# EAGLE design pcb 06 (EAGLE 9.2.0)
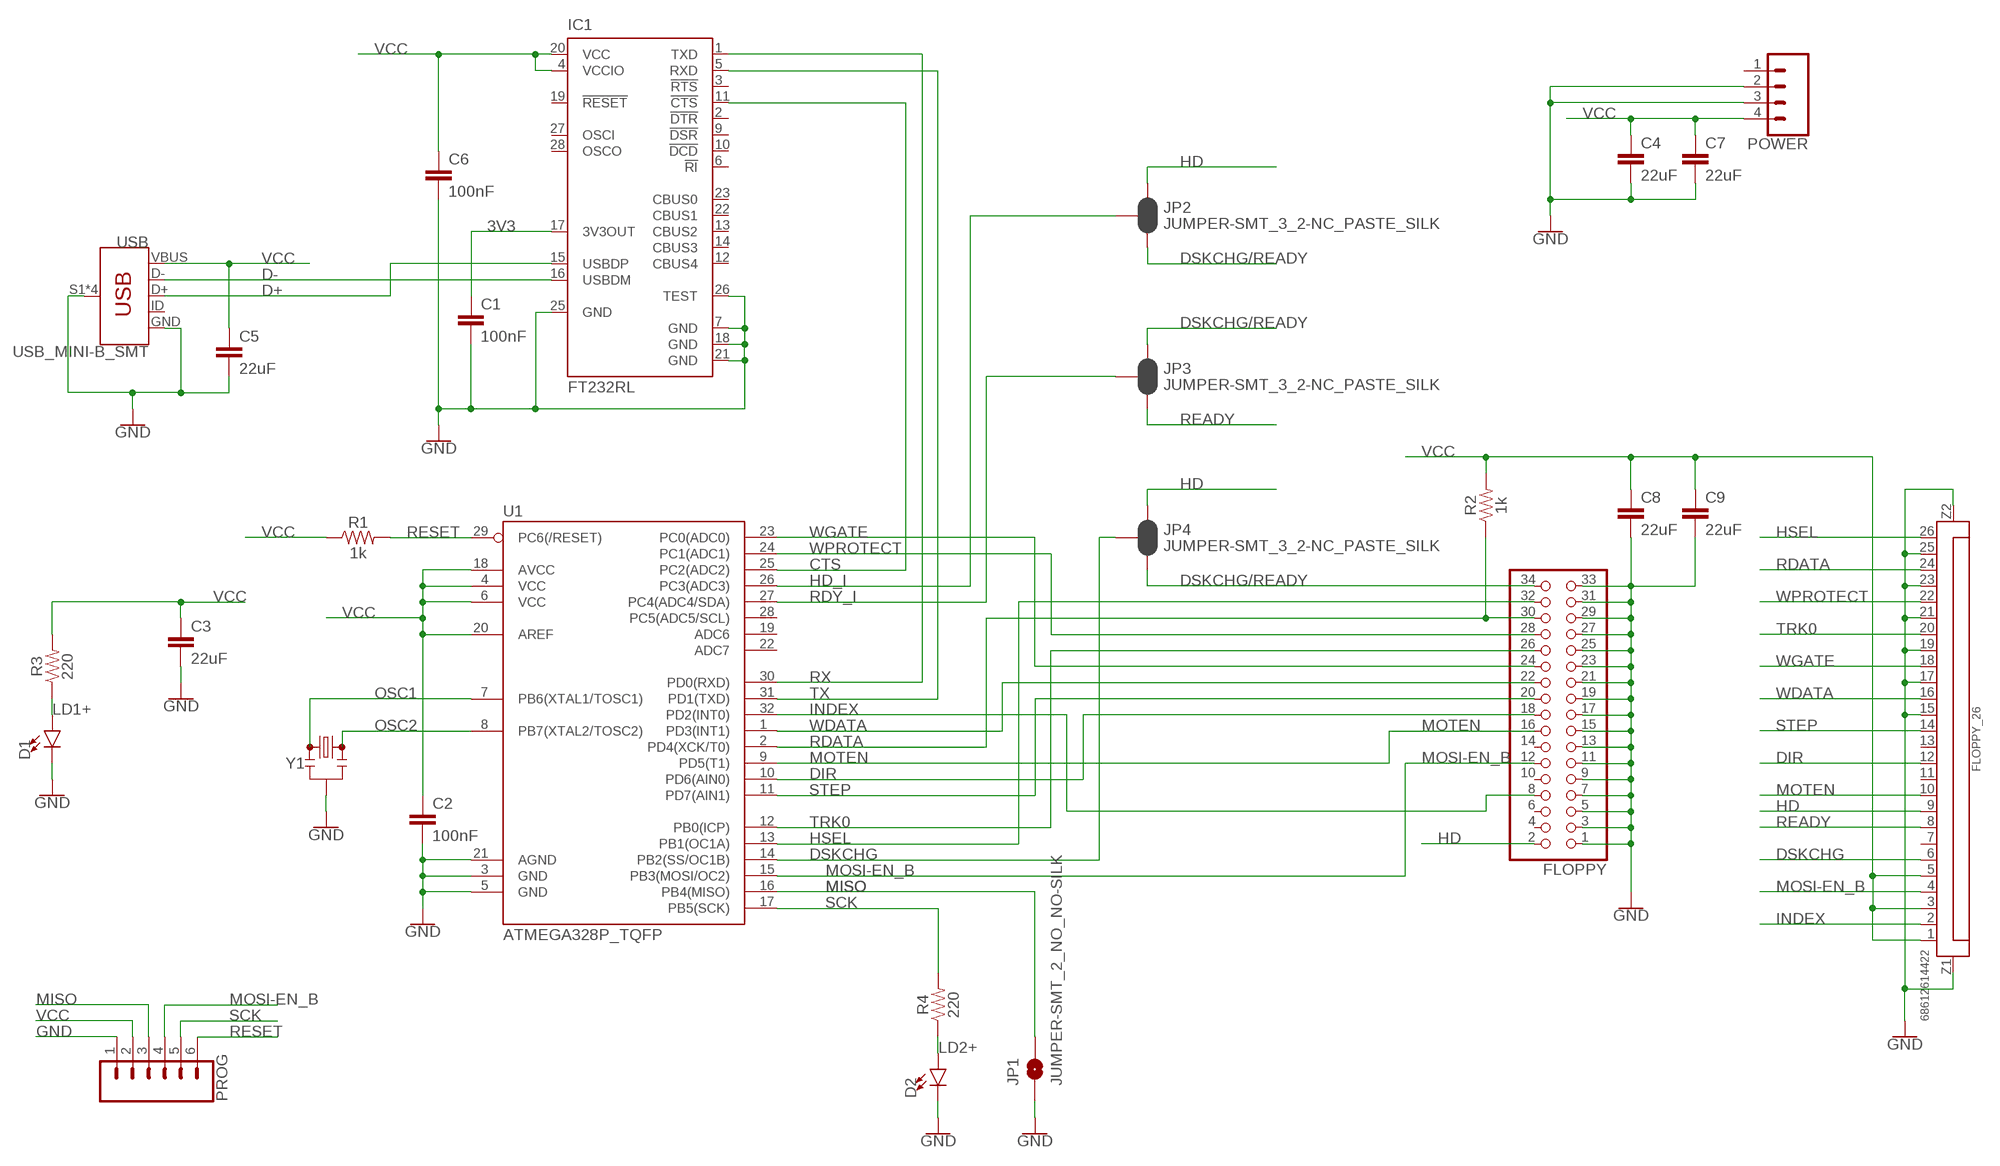
[diagram p0: schematic, sheet 1]

## Parts
C1  100nF  1.0UF-0603-16V-10%  [0603]
C2  100nF  1.0UF-0603-16V-10%  [0603]
C3  22uF  C-EUC0805  [C0805]
C4  22uF  C-EUC0805  [C0805]
C5  22uF  C-EUC0805  [C0805]
C6  100nF  1.0UF-0603-16V-10%  [0603]
C7  22uF  C-EUC0805  [C0805]
C8  22uF  C-EUC0805  [C0805]
C9  22uF  C-EUC0805  [C0805]
D1  LED5MM  [LED_5MM]
D2  LED5MM  [LED_5MM]
FLOPPY  PINHD-2X17_2.54-90°  [2X17/90]
FLOPPY_26  68612614422  6861XX14422_68612614422  [68612614422]
IC1  FT232RL  [SSOP28]
JP1  JUMPER-SMT_2_NO_NO-SILK  [SMT-JUMPER_2_NO_NO-SILK]
JP2  JUMPER-SMT_3_2-NC_PASTE_SILK  [SMT-JUMPER_3_2-NC_PASTE_SILK]
JP3  JUMPER-SMT_3_2-NC_PASTE_SILK  [SMT-JUMPER_3_2-NC_PASTE_SILK]
JP4  JUMPER-SMT_3_2-NC_PASTE_SILK  [SMT-JUMPER_3_2-NC_PASTE_SILK]
POWER  CONN_04  [1X04]
PROG  CONN_06SILK_FEMALE_PTH  [1X06]
R1  1k  10KOHM-0603-1/10W-1%  [0603]
R2  1k  10KOHM-0603-1/10W-1%  [0603]
R3  220  10KOHM-0603-1/10W-1%  [0603]
R4  220  10KOHM-0603-1/10W-1%  [0603]
U1  ATMEGA328P_TQFP  [TQFP32-08]
USB  USB_MINI-B_SMT  [USB-MINIB]
Y1  RESONATORSMD-3.2X1.3  [RESONATOR-SMD-3.2X1.3]

## Nets
3V3: C1.1 IC1.17(3V3OUT)
CTS: IC1.11(!CTS) U1.25(PC2(ADC2))
D+: IC1.15(USBDP) USB.D+
D-: IC1.16(USBDM) USB.D-
DIR: FLOPPY.18 FLOPPY_26.12 U1.10(PD6(AIN0))
DSKCHG: FLOPPY_26.6 JP4.2 U1.14(PB2(SS/OC1B))
DSKCHG/READY: FLOPPY.34 JP2.3 JP3.1 JP4.3
GND: C1.2 C2.2 C3.2 C4.2 C5.2 C6.2 C7.2 C8.2 C9.2 D1.K(C) D2.K(C) FLOPPY.1 FLOPPY.3 FLOPPY.5 FLOPPY.7 FLOPPY.9 FLOPPY.11 FLOPPY.13 FLOPPY.15 FLOPPY.17 FLOPPY.19 FLOPPY.21 FLOPPY.23 FLOPPY.25 FLOPPY.27 FLOPPY.29 FLOPPY.31 FLOPPY.33 FLOPPY_26.15 FLOPPY_26.17 FLOPPY_26.19 FLOPPY_26.21 FLOPPY_26.23 FLOPPY_26.25 FLOPPY_26.Z1 FLOPPY_26.Z2 IC1.7(GND) IC1.18(GND) IC1.21(GND) IC1.25(GND) IC1.26(TEST) JP1.1 POWER.2 POWER.3 PROG.1 U1.3(GND) U1.5(GND) U1.21(AGND) USB.GND USB.S1(SHIELD) USB.S2(SHIELD) USB.S3(SHIELD) USB.S4(SHIELD) Y1.2
HD: FLOPPY.2 FLOPPY_26.9 JP2.1 JP4.1
HD_I: JP2.2 U1.26(PC3(ADC3))
HSEL: FLOPPY.32 FLOPPY_26.26 U1.13(PB1(OC1A))
INDEX: FLOPPY.8 FLOPPY_26.2 U1.32(PD2(INT0))
LD1+: D1.A R3.1
LD2+: D2.A R4.1
MISO: JP1.2 PROG.3 U1.16(PB4(MISO))
MOSI-EN_B: FLOPPY.12 FLOPPY_26.4 PROG.4 U1.15(PB3(MOSI/OC2))
MOTEN: FLOPPY.16 FLOPPY_26.10 U1.9(PD5(T1))
OSC1: U1.7(PB6(XTAL1/TOSC1)) Y1.1
OSC2: U1.8(PB7(XTAL2/TOSC2)) Y1.3
RDATA: FLOPPY.30 FLOPPY_26.24 R2.1 U1.2(PD4(XCK/T0))
RDY_I: JP3.2 U1.27(PC4(ADC4/SDA))
READY: FLOPPY_26.8 JP3.3
RESET: PROG.6 R1.2 U1.29(PC6(/RESET))
RX: IC1.1(TXD) U1.30(PD0(RXD))
SCK: PROG.5 R4.2 U1.17(PB5(SCK))
STEP: FLOPPY.20 FLOPPY_26.14 U1.11(PD7(AIN1))
TRK0: FLOPPY.26 FLOPPY_26.20 U1.12(PB0(ICP))
TX: IC1.5(RXD) U1.31(PD1(TXD))
VCC: C2.1 C3.1 C4.1 C5.1 C6.1 C7.1 C8.1 C9.1 FLOPPY_26.1 FLOPPY_26.3 FLOPPY_26.5 IC1.4(VCCIO) IC1.20(VCC) POWER.4 PROG.2 R1.1 R2.2 R3.2 U1.4(VCC) U1.6(VCC) U1.18(AVCC) U1.20(AREF) USB.VBUS
WDATA: FLOPPY.22 FLOPPY_26.16 U1.1(PD3(INT1))
WGATE: FLOPPY.24 FLOPPY_26.18 U1.23(PC0(ADC0))
WPROTECT: FLOPPY.28 FLOPPY_26.22 U1.24(PC1(ADC1))
Unconnected: FLOPPY.4 FLOPPY.6 FLOPPY.10 FLOPPY.14 FLOPPY_26.7 FLOPPY_26.11 FLOPPY_26.13 IC1.2(!DTR) IC1.3(!RTS) IC1.6(!RI) IC1.9(!DSR) IC1.10(!DCD) IC1.12(CBUS4) IC1.13(CBUS2) IC1.14(CBUS3) IC1.19(!RESET) IC1.22(CBUS1) IC1.23(CBUS0) IC1.27(OSCI) IC1.28(OSCO) POWER.1 U1.19(ADC6) U1.22(ADC7) U1.28(PC5(ADC5/SCL)) USB.ID

## Library data of the parts
C1 C2 C6 = SparkFun-Capacitors:1.0UF: 1µF ceramic capacitors A capacitor is a passive two-terminal electrical component used to store electrical energy temporarily in an electric field.; PROD_ID: CAP-00868; VALUE: 1.0uF
C3-C5 C7-C9 = resistor:C-EU: CAPACITOR, European symbol
D1 D2 = SparkFun-LED:LED: LED (Generic) Standard schematic elements and footprints for 5mm, 3mm, 1206, and 0603 sized LEDs. Generic LEDs with no color specified.
FLOPPY = pinhead-1:PINHD-2X17: PIN HEADER
FLOPPY_26 = Wurth_Connectors_WR-FPC:6861XX14422_68612614422: WR-FPC 1.00 mm SMT ZIF Horizontal Bottom Contact KIND PROPERTIES Pitch 1 mm MATERIAL PROPERTIES Insulator Material PPS Contact Material Phosphor Bronze Contact Plating 100 (µ") Tin over 50 (µ") Nickel Contact Type Stamped <https://www.we-online.com/catalog/media/o33099v209%20Family_WR-FPC_68611214422.jpg> Details see: https://www.we-online.com/catalog/en/FPC_1_00_SMT_ZIF_HORIZONTAL_BOTTOM_CONTACT_6861XX14422/ Updated by Ella Wu 2020-08-26 2020(C) Wurth Elektronik; CONTACT-RESISTANCE: 20Ohm; DATASHEET-URL: https://www.we-online.com/catalog/datasheet/68612614422.pdf; IR: 1A; L: 33mm; MATE-WITH: WR-FFC 1.00 mm Flat Flexible Cable Type 1 (Contacts on same side)/ Type 2 (Contacts opposite); PACKAGING: Tape and Reel; PART-NUMBER: 68612614422; PINS: 26; PITCH: 1mm; TYPE: Horizontal; WORKING-VOLTAGE: 125V(AC)
IC1 = ftdichip:FT232R: Source: http://www.ftdichip.com/Documents/DataSheets/DS_FT232R_v104.pdf; MPN: FT232RL; OC_FARNELL: 1146032; OC_NEWARK: 91K9918
JP1 = SparkFun-Jumpers:JUMPER-SMT_2_NO: Normally open jumper This jumper has two pads in close proximity to each other. Apply solder to close the connection. Round pads are easier to solder for beginners, but are a lot larger. SparkFun Product that uses the round pads: SparkFun EL Sequencer <https://www.sparkfun.com/products/12781>
JP2-JP4 = SparkFun-Jumpers:JUMPER-SMT_3_2-NC_PASTE: Normally closed solder jumper (2 of 2 connections) This jumper has an aperture in the stencil to allow solder paste to bridge both connections. Both connections are normally closed (NC). Wick off the solder to open the connection(s). Reapply solder to reclose the connection(s).
POWER = SparkFun-Connectors:CONN_04: Multi connection point. Often used as Generic Header-pin footprint for 0.1 inch spaced/style header connections On any of the 0.1 inch spaced packages, you can populate with these: Break Away Headers - Straight <https://www.sparkfun.com/products/116> (PRT-00116) Break Away Male Headers - Right Angle <https://www.sparkfun.com/products/553> (PRT-00553) Female Headers <https://www.sparkfun.com/products/115> (PRT-00115) Break Away Headers - Machine Pin <https://www.sparkfun.com/products/117> (PRT-00117) Break Away Female Headers - Swiss Machine Pin <https://www.sparkfun.com/products/743> (PRT-00743) For SCREWTERMINALS and SPRING TERMINALS visit here: Screw Terimnals on SparkFun.com <https://www.sparkfun.com/search/results?term=Screw+Terminals> (5mm/3.5mm/2.54mm spacing) This device is also useful as a general connection point to wire up your design to another part of your project. Our various solder wires solder well into these plated through hole pads. Hook-Up Wire - Assortment (Stranded, 22 AWG) <https://www.sparkfun.com/products/11375> (PRT-11375) Hook-Up Wire - Assortment (Solid Core, 22 AWG) <https://www.sparkfun.com/products/11367> (PRT-11367) View the entire wire category on our website here <https://www.sparkfun.com/categories/141> Special notes: Molex polarized connector foot print use with SKU : PRT-08231 with associated crimp pins and housings. 1MM SMD Version SKU: PRT-10208; PROD_ID: CONN-09696
PROG = SparkFun-Connectors:CONN_06: Multi connection point. Often used as Generic Header-pin footprint for 0.1 inch spaced/style header connections On any of the 0.1 inch spaced packages, you can populate with these: Break Away Headers - Straight <https://www.sparkfun.com/products/116> (PRT-00116) Break Away Male Headers - Right Angle <https://www.sparkfun.com/products/553> (PRT-00553) Female Headers <https://www.sparkfun.com/products/115> (PRT-00115) Break Away Headers - Machine Pin <https://www.sparkfun.com/products/117> (PRT-00117) Break Away Female Headers - Swiss Machine Pin <https://www.sparkfun.com/products/743> (PRT-00743) Arduino Stackable Header - 6 Pin <https://www.sparkfun.com/products/9280> (PRT-09280) For SCREWTERMINALS and SPRING TERMINALS visit here: Screw Terimnals on SparkFun.com <https://www.sparkfun.com/search/results?term=Screw+Terminals> (5mm/3.5mm/2.54mm spacing) This device is also useful as a general connection point to wire up your design to another part of your project. Our various solder wires solder well into these plated through hole pads. Hook-Up Wire - Assortment (Stranded, 22 AWG) <https://www.sparkfun.com/products/11375> (PRT-11375) Hook-Up Wire - Assortment (Solid Core, 22 AWG) <https://www.sparkfun.com/products/11367> (PRT-11367) View the entire wire category on our website here <https://www.sparkfun.com/categories/141>; PROD_ID: CONN-08437
R1-R4 = SparkFun-Resistors:10KOHM: 10kΩ resistor A resistor is a passive two-terminal electrical component that implements electrical resistance as a circuit element. Resistors act to reduce current flow, and, at the same time, act to lower voltage levels within circuits. - Wikipedia; PROD_ID: RES-00824; VALUE: 10k
U1 = SparkFun-IC-Microcontroller:ATMEGA328P_TQFP: Popular 328P in QFP Storefront component: ATmega328 - TQFP <https://www.sparkfun.com/products/13448> (COM-13448) Datasheet <http://www.sparkfun.com/datasheets/Components/SMD/ATMega328.pdf> SparkFun Products SparkFun RedBoard - Programmed with Arduino <https://www.sparkfun.com/products/12757> (DEV-12757) Arduino Pro Mini 328 - 5V/16MHz <https://www.sparkfun.com/products/11113> (DEV-11113) Arduino Pro Mini 328 - 3.3V/8MHz <https://www.sparkfun.com/products/11114> (DEV-11114) SparkFun OpenLog <https://www.sparkfun.com/products/13712> (DEV-13712) SparkFun MicroView - OLED Arduino Module <https://www.sparkfun.com/products/12923> (DEV-12923) SparkFun Digital Sandbox <https://www.sparkfun.com/products/12651> (DEV-12651) SparkFun PicoBoard <https://www.sparkfun.com/products/11888> (WIG-11888) Arduino Fio <https://www.sparkfun.com/products/10116> (DEV-10116) LilyPad Arduino 328 Main Board <https://www.sparkfun.com/products/13342> (DEV-13342) SparkFun RedStick <https://www.sparkfun.com/products/13741> (DEV-13741) LilyPad MP3 <https://www.sparkfun.com/products/11013> (DEV-11013) LilyPad Arduino SimpleSnap <https://www.sparkfun.com/products/10941> (DEV-10941) SparkFun Stepoko <https://www.sparkfun.com/products/13899> (ROB-13899) SparkFun Geiger Counter <https://www.sparkfun.com/products/11345> (SEN-11345) SparkFun EL Sequencer <https://www.sparkfun.com/products/12781> (COM-12781) Arduino Pro 328 - 5V/16MHz <https://www.sparkfun.com/products/10915> (DEV-10915) CryptoCape <https://www.sparkfun.com/products/12773> (DEV-12773) SparkFun IR Thermometer Evaluation Board - MLX90614 <https://www.sparkfun.com/products/10740> (SEN-10740) SparkFun RedBot Mainboard <https://www.sparkfun.com/products/12097> (ROB-12097) Arduino Pro 328 - 3.3V/8MHz <https://www.sparkfun.com/products/10914> (DEV-10914) SparkFun Block for Intel® Edison - Arduino <https://www.sparkfun.com/products/13036> (DEV-13036) SparkFun Simon Says - Surface Mount Soldering Kit <https://www.sparkfun.com/products/10935> (KIT-10935) SparkFun 7-Segment Serial Display - Red <https://www.sparkfun.com/products/11441> (COM-11441) SparkFun 7-Segment Serial Display - White <https://www.sparkfun.com/products/11629> (COM-11629) SparkFun 7-Segment Serial Display - Yellow <https://www.sparkfun.com/products/11443> (COM-11443) SparkFun 7-Segment Serial Display - Kelly Green <https://www.sparkfun.com/products/11440> (COM-11440) SparkFun 7-Segment Serial Display - Blue <https://www.sparkfun.com/products/11442> (COM-11442) SparkFun OpenSegment Serial Display - 20mm (Blue) <https://www.sparkfun.com/products/11647> (COM-11647) SparkFun OpenSegment Serial Display - 20mm (Green) <https://www.sparkfun.com/products/11646> (COM-11646) SparkFun OpenSegment Serial Display - 20mm (White) <https://www.sparkfun.com/products/11648> (COM-11648) SparkFun OpenSegment Serial Display - 20mm (Red) <https://www.sparkfun.com/products/11644> (COM-11644) SparkFun OpenSegment Serial Display - 20mm (Yellow) <https://www.sparkfun.com/products/11645> (COM-11645) SparkFun OpenSegment Shield <https://www.sparkfun.com/products/13190> (DEV-13190); PROD_ID: IC-09069
USB = SparkFun-Connectors:USB_MINI-B: USB type Mini-B Connector Breaks out 5th pin, and includes shield pins if needed. SparkFun Products: SparkFun FTDI Basic Breakout <https://www.sparkfun.com/products/9716> SparkFun XBee Explorer USB <https://www.sparkfun.com/products/11812> SparkFun Redboard <https://www.sparkfun.com/products/12757>; PROD_ID: CONN-08193; SF_ID: PRT-00587
Y1 = SparkFun-Clocks:RESONATOR: Resonators (Generic) Ceramic resonators are clock-generating components, often used to control timing in microcontrollers. They usually have 3 pins: two pins for oscillation, and one pin for ground. Compared to crystals, resonators have worse tolerance, but are usually much cheaper. Plus, they have built-in load capacitors! These devices are used on boards like the Arduino Pro 8MHz <https://www.sparkfun.com/products/11114> and Arduino Pro 16MHz <https://www.sparkfun.com/products/11113>.

## Board
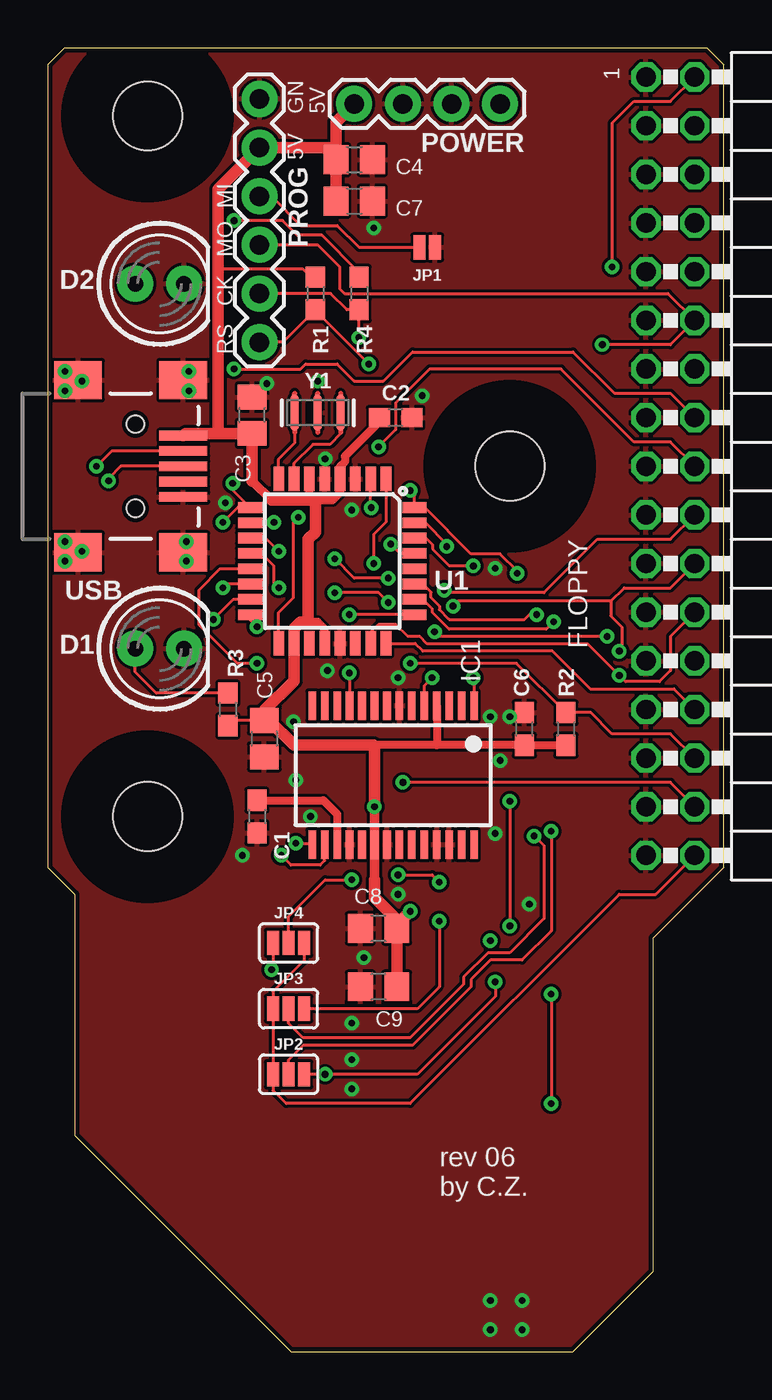
[diagram p1: board, top side]
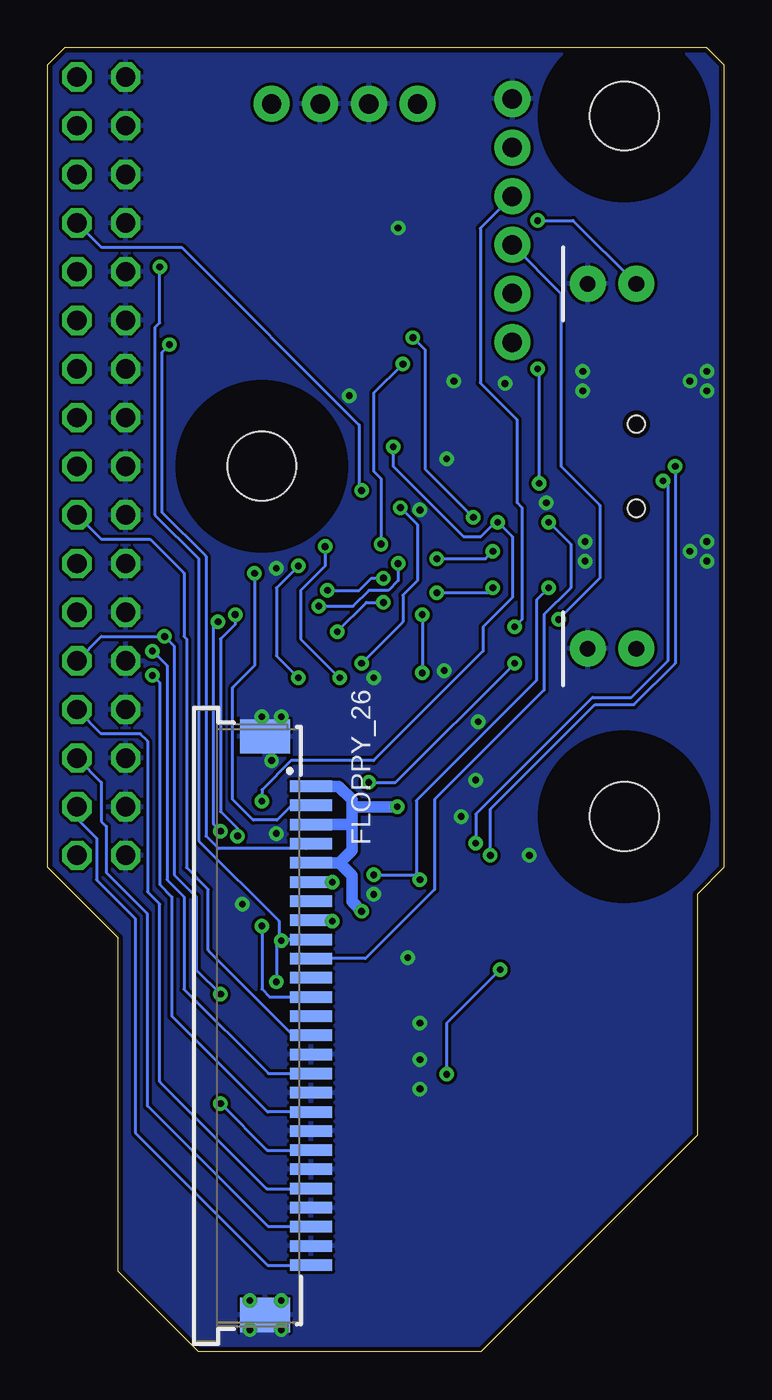
[diagram p2: board, bottom side, seen from below]

Size 35.31 x 68.07 mm. Coordinates in mm from the lower left corner, seen from the top.
Outline: 0,67.18 0,25.27 1.4,23.88 1.4,11.3 12.7,0 27.43,0 31.62,4.19 31.62,21.59 35.31,25.27 35.31,67.18 34.42,68.07 0.89,68.07 0,67.18
Copper layers (1*16): Top 0.035mm / dielectric 1.5mm / Bottom 0.035mm
Design rules "default *": minimum track width 6mil, minimum drill 0.35mm, track to track 6mil, track to pad 6mil, pad to pad 6mil, via to via 6mil, smd to smd 6mil, copper to edge 10mil, drill to drill 6mil, minimum pad ring 10mil, minimum via ring 8mil, stop-mask expansion 4mil, vias tented up to drill 200mil, thermal gap 6mil
Holes 3.6 mm at 5.21,27.94 5.21,64.52 24.13,46.23
tRestrict: area 0.7,23.4 to 9.7,32.4; area 0.7,60 to 9.7,69; area 19.6,41.7 to 28.6,50.7
bRestrict: area 0.7,23.4 to 9.7,32.4; area 0.7,60 to 9.7,69; area 19.6,41.7 to 28.6,50.7

### Footprints (pad centres in the part's own frame; a part is rotated, then mirrored left to right if it is on the bottom)
0603 = smd 1.1 x 1: 1 -0.85,0; 2 0.85,0
C0805 = smd 1.3 x 1.5: 1 -0.95,0; 2 0.95,0
LED_5MM = drill 0.813 pad 1.88: A -1.27,0; K 1.27,0
2X17/90 = drill 1.016 octagon: 1 -20.32,-6.35; 2 -20.32,-3.81; 3 -17.78,-6.35; 4 -17.78,-3.81; 5 -15.24,-6.35; 6 -15.24,-3.81; 7 -12.7,-6.35; 8 -12.7,-3.81; 9 -10.16,-6.35; 10 -10.16,-3.81; 11 -7.62,-6.35; 12 -7.62,-3.81; 13 -5.08,-6.35; 14 -5.08,-3.81; 15 -2.54,-6.35; 16 -2.54,-3.81; 17 0,-6.35; 18 0,-3.81; 19 2.54,-6.35; 20 2.54,-3.81; 21 5.08,-6.35; 22 5.08,-3.81; 23 7.62,-6.35; 24 7.62,-3.81; 25 10.16,-6.35; 26 10.16,-3.81; 27 12.7,-6.35; 28 12.7,-3.81; 29 15.24,-6.35; 30 15.24,-3.81; 31 17.78,-6.35; 32 17.78,-3.81; 33 20.32,-6.35; 34 20.32,-3.81
68612614422 = smd 0.6 x 2.2: 1 -12.5,3.33; 2 -11.5,3.33; 3 -10.5,3.33; 4 -9.5,3.33; 5 -8.5,3.33; 6 -7.5,3.33; 7 -6.5,3.33; 8 -5.5,3.33; 9 -4.5,3.33; 10 -3.5,3.33; 11 -2.5,3.33; 12 -1.5,3.33; 13 -0.5,3.33; 14 0.5,3.33; 15 1.5,3.33; 16 2.5,3.33; 17 3.5,3.33; 18 4.5,3.33; 19 5.5,3.33; 20 6.5,3.33; 21 7.5,3.33; 22 8.5,3.33; 23 9.5,3.33; 24 10.5,3.33; 25 11.5,3.33; 26 12.5,3.33 | smd 1.8 x 2.6: Z1 -15.1,0.93; Z2 15.1,0.93
SSOP28 = smd 0.4 x 1.5: 1 -4.225,-3.625; 2 -3.575,-3.625; 3 -2.925,-3.625; 4 -2.275,-3.625; 5 -1.625,-3.625; 6 -0.975,-3.625; 7 -0.325,-3.625; 8 0.325,-3.625; 9 0.975,-3.625; 10 1.625,-3.625; 11 2.275,-3.625; 12 2.925,-3.625; 13 3.575,-3.625; 14 4.225,-3.625; 15 4.225,3.625; 16 3.575,3.625; 17 2.925,3.625; 18 2.275,3.625; 19 1.625,3.625; 20 0.975,3.625; 21 0.325,3.625; 22 -0.325,3.625; 23 -0.975,3.625; 24 -1.625,3.625; 25 -2.275,3.625; 26 -2.925,3.625; 27 -3.575,3.625; 28 -4.225,3.625
SMT-JUMPER_2_NO_NO-SILK = smd 0.635 x 1.27: 1 -0.406,0; 2 0.406,0
SMT-JUMPER_3_2-NC_PASTE_SILK = smd 0.635 x 1.27: 1 -0.813,0; 2 0,0; 3 0.813,0
1X04 = drill 1.016 pad 1.88: 1 0,0; 2 2.54,0; 3 5.08,0; 4 7.62,0
1X06 = drill 1.016 pad 1.88: 1 0,0; 2 2.54,0; 3 5.08,0; 4 7.62,0; 5 10.16,0; 6 12.7,0
TQFP32-08 = smd 1.27 x 0.559: 1 -4.293,2.8; 2 -4.293,2; 3 -4.293,1.2; 4 -4.293,0.4; 5 -4.293,-0.4; 6 -4.293,-1.2; 7 -4.293,-2; 8 -4.293,-2.8; 17 4.293,-2.8; 18 4.293,-2; 19 4.293,-1.2; 20 4.293,-0.4; 21 4.293,0.4; 22 4.293,1.2; 23 4.293,2; 24 4.293,2.8 | smd 0.559 x 1.27: 9 -2.8,-4.293; 10 -2,-4.293; 11 -1.2,-4.293; 12 -0.4,-4.293; 13 0.4,-4.293; 14 1.2,-4.293; 15 2,-4.293; 16 2.8,-4.293; 25 2.8,4.293; 26 2,4.293; 27 1.2,4.293; 28 0.4,4.293; 29 -0.4,4.293; 30 -1.2,4.293; 31 -2,4.293; 32 -2.8,4.293
USB-MINIB = smd 2.5 x 0.5: D+ 2.5,0; D- 2.5,0.8; GND 2.5,-1.6; ID 2.5,-0.8; VBUS 2.5,1.6 | smd 2.5 x 2: S1 -3,4.5; S2 2.5,4.5; S3 -3,-4.5; S4 2.5,-4.5 | hole 0.9: 0,2.2; 0,-2.2
RESONATOR-SMD-3.2X1.3 = smd 0.45 x 1.905: 1 -1.2,0; 2 0,0; 3 1.2,0

### Placement (x,y rotation side)
C1  10.92,27.94 270 top
C2  18.16,48.77 0 top
C3  10.67,48.9 90 top
C4  16,62.23 0 top
C5  11.3,32 270 top
C6  24.89,32.51 90 top
C7  16,60.07 0 top
C8  17.27,22.1 180 top
C9  17.27,19.05 180 top
D1  5.84,36.7 0 top
D2  5.84,55.75 0 top
FLOPPY  37.59,46.23 270 top
FLOPPY_26  24.89,17.02 270 bottom
IC1  18.03,30.1 180 top
JP1  19.81,57.66 180 top
JP2  12.57,14.48 180 top
JP3  12.57,17.91 0 top
JP4  12.57,21.34 0 top
POWER  23.62,65.15 180 top
PROG  11.05,65.41 270 top
R1  13.97,55.25 270 top
R2  27.05,32.51 270 top
R3  9.4,33.53 270 top
R4  16.26,55.25 270 top
U1  14.86,41.28 270 top
USB  4.57,46.23 0 top
Y1  14.1,49.02 180 top

### Tracks (layer width: path | path; a pad name or v marks a point on that pad's centre or on a via)
3V3
  Top 0.406: C1.1 14.39,28.79 15.11,28.07 IC1.17
CTS  (via drill 0.35)
  Top 0.152: U1.25 v15.75,38.48 | v15.75,35.43 v15.76,35.42 IC1.11
  Bottom 0.152: v15.75,38.48 v15.75,35.43
D+  (via drill 0.35)
  Top 0.152: USB.D+ 3.81,46.23 3.17,45.59 v3.17,45.47 | v12.95,26.54 13.74,26.54 IC1.15
  Bottom 0.152: v3.17,45.47 2.92,45.21 2.92,36.07 4.83,34.16 6.86,34.16 12.95,28.07 v12.95,26.54
D-  (via drill 0.35)
  Top 0.152: USB.D- 3.34,47.03 v2.54,46.23 | v12.19,25.91 12.7,25.4 14.22,25.4 14.46,25.64 IC1.16
  Bottom 0.152: v2.54,46.23 2.54,35.94 4.7,33.78 6.73,33.78 12.19,28.32 v12.19,25.91
DIR  (via drill 0.35)
  Top 0.152: U1.10 11.78,43.28 v11.81,43.31 | FLOPPY.18 32.51,47.5 30.61,47.5 26.8,51.31 19.94,51.31 18.16,49.53 18.16,48.13 v17.27,47.24 | v24.13,28.74 v24.13,22.23
  Bottom 0.152: v17.27,47.24 17.27,46.23 13.59,42.55 12.7,42.55 11.94,43.31 v11.81,43.31 11.05,42.55 11.05,39.37 12.57,37.85 12.57,36.58 18.29,30.86 22.61,30.86 24.13,29.34 v24.13,28.74 | v24.13,22.23 24.13,18.93 23.72,18.52 FLOPPY_26.12
DSKCHG  (via drill 0.35)
  Top 0.152: v15.88,24.64 14.48,24.64 12.57,22.73 JP4.2 | v18.29,24.89 20.07,24.89 v20.45,24.51 | U1.14 9.34,40.08 v9.14,39.88
  Bottom 0.152: v9.14,39.88 9.78,39.24 9.78,35.05 16.07,28.77 16.07,24.83 v15.88,24.64 16.13,24.89 v18.29,24.89 | FLOPPY_26.6 20.45,24.52 v20.45,24.51
DSKCHG/READY
  Top 0.152: JP2.3 11.76,13.64 12.45,12.95 18.92,12.95 29.85,23.88 31.75,23.88 FLOPPY.34 | JP3.1 JP2.3 | JP2.3 11.76,18.8 13.39,20.42 JP4.3
GND  (via drill 0.35)
  other vias: 14.61,35.56 18.29,35.18 15.88,43.94 19.56,49.91 23.37,40.89 14.1,50.67 14.48,46.61 17.02,58.67 24.13,33.15 18.29,23.88 12.95,29.85 10.16,25.91 11.43,50.55 0.89,41.28 9.27,44.32 0.89,42.29 1.78,41.78 7.24,41.28 7.24,42.29 7.37,50.17 7.37,51.18 0.89,50.17 0.89,51.18 1.78,50.67 12.83,32.89 13.72,27.94 23.62,30.86 23.11,33.15 24.77,2.67 24.77,1.14 23.11,1.14 23.11,2.67 23.37,27.05 25.15,23.37 16.51,20.57 15.88,17.15 15.88,15.24 15.88,13.72
  pour Bottom: -1.78,70.36 54.1,70.36 54.1,-3.3 -1.78,-3.3
  pour Top (rank 2): -3.05,71.63 52.83,71.63 52.83,-2.03 -3.05,-2.03
  pour Bottom (no thermals): 22.73,0.38 25.27,0.38 25.27,2.79 22.73,2.79
  pour Bottom (no thermals): 25.27,33.66 22.73,33.66 22.73,31.24 25.27,31.24
HD  (via drill 0.35)
  Top 0.152: JP2.1 v14.48,14.48 19.3,14.48 23.37,18.54 v23.37,19.3 | v29.46,56.64 29.46,64.14 30.61,65.28 32.51,65.28 FLOPPY.2 | JP4.1 11.76,20.02 v11.68,19.94
  Bottom 0.152: v29.46,56.64 29.46,53.72 29.72,53.47 29.72,43.69 27.43,41.4 27.43,26.67 23.24,22.48 23.24,21.72 23.04,21.52 FLOPPY_26.9 23.06,21.52 v23.11,21.46 23.37,21.21 v23.37,19.3 | v11.68,19.94 14.48,17.15 v14.48,14.48
HD_I  (via drill 0.35)
  Top 0.152: U1.26 19.59,39.28 20.07,38.8 20.07,38.61 20.96,37.72 26.04,37.72 v26.42,38.1 | JP2.2 12.57,15.24 13.34,16 19.05,16 22.1,19.05 22.1,19.43 23.11,20.45 24.77,20.45 26.29,21.97 v26.29,27.18
  Bottom 0.152: v26.42,38.1 26.67,37.85 26.67,27.56 v26.29,27.18
HSEL  (via drill 0.35)
  Top 0.152: FLOPPY.32 32.51,29.72 v18.54,29.72 | U1.13 9,40.88 7.87,39.75 7.87,37.97 9.91,35.94 v10.92,35.94
  Bottom 0.152: v18.54,29.72 17.14,29.72 v10.92,35.94 | FLOPPY.32 33.78,27.81 32.77,26.8 32.77,24.64 30.73,22.61 30.73,11.43 23.82,4.52 FLOPPY_26.26
INDEX  (via drill 0.35)
  Top 0.152: v18.92,44.96 19.15,44.73 U1.32 19.68,44.08 22.1,41.66 23.62,41.66 24.51,40.77 v24.51,40.64
  Bottom 0.152: v18.92,44.96 19.05,45.09 19.05,48.39 28.32,57.66 32.51,57.66 FLOPPY.8 | FLOPPY_26.2 22.58,28.52 23.34,27.76 24.58,27.76 25.65,28.83 25.65,34.67 24.51,35.81 v24.51,40.64
LD1+
  Top 0.152: D1.A 4.57,35.47 5.67,34.38 R3.1
LD2+  (via drill 0.35)
  Top 0.152: R4.1 16.26,56.35 14.31,58.29 13.03,58.29 12.27,59.06 v9.73,59.06
  Bottom 0.152: D2.A 7.87,59.06 v9.73,59.06
MISO  (via drill 0.35)
  Top 0.152: U1.16 10.57,38.2 v10.92,37.85 | PROG.3 11.68,60.33 13.21,58.8 15.11,58.8 16.26,57.66 JP1.2
  Bottom 0.152: PROG.3 12.73,58.65 12.73,50.57 10.8,48.64 10.8,44.32 10.54,44.07 10.54,38.23 v10.92,37.85
MOSI-EN_B  (via drill 0.35)
  Top 0.152: v8.64,38.23 9.68,39.28 U1.15 | PROG.4 14.1,57.78 15.24,56.64 15.24,55.5 15.49,55.25 32.38,55.25 FLOPPY.12 32.51,52.58 v28.96,52.58
  Bottom 0.152: PROG.4 8.51,55.25 8.51,46.23 6.48,44.2 6.48,40.39 v8.64,38.23 | FLOPPY_26.4 21.82,26.26 26.39,26.26 27.05,26.92 27.05,41.53 29.34,43.81 29.34,52.2 v28.96,52.58
MOTEN  (via drill 0.35)
  Top 0.152: v9.73,51.31 13.21,51.31 13.46,51.56 15.11,51.56 16,50.67 17.53,50.67 19.05,52.2 27.43,52.2 29.59,50.04 32.51,50.04 FLOPPY.16 | v9.65,45.34 9.65,44.99 U1.9 9.91,44.08 v9.14,43.31
  Bottom 0.152: v9.65,45.34 9.65,51.23 v9.73,51.31 | v9.14,43.31 8,42.16 8,39.88 9.4,38.48 9.4,34.54 15.11,28.83 15.11,24.13 18.73,20.52 FLOPPY_26.10
OSC1
  Top 0.152: U1.7 12.86,46.39 13.84,47.37 14.73,47.37 15.3,47.94 Y1.1
OSC2
  Top 0.152: U1.8 12.06,46.6 12.9,47.44 Y1.3
RDATA  (via drill 0.35)
  Top 0.152: FLOPPY.30 32.51,32.26 29.46,32.26 28.36,33.36 R2.1 24.47,35.94 v18.92,35.94 | v16.89,44.07 16.86,44.1 U1.2
  Bottom 0.152: v18.92,35.94 16.76,38.1 16.76,39.5 16,40.26 16,43.18 v16.89,44.07 | FLOPPY.30 32.51,29.72 32.51,27.69 32.26,27.43 32.26,25.02 30.1,22.86 30.1,12.83 23.79,6.52 FLOPPY_26.24
RDY_I  (via drill 0.35)
  Top 0.152: U1.27 19.59,40.08 20.02,39.65 20.02,39.37 20.45,38.94 20.45,38.73 20.96,38.23 24.89,38.23 25.15,38.48 v25.53,38.48 | v25.4,26.92 25.91,26.42 25.91,22.61 24.13,20.83 22.99,20.83 21.72,19.56 21.72,19.18 18.92,16.38 13.34,16.38 12.57,17.15 JP3.2
  Bottom 0.152: v25.53,38.48 25.53,37.97 26.29,37.21 26.29,28.19 25.4,27.3 v25.4,26.92
READY  (via drill 0.35)
  Top 0.152: v20.45,22.48 20.45,19.05 19.3,17.91 JP3.3
  Bottom 0.152: FLOPPY_26.8 21.52,22.48 v20.45,22.48
RESET  (via drill 0.35)
  Top 0.152: PROG.6 12.28,52.7 R1.2 13.97,54.36 v16.76,51.56 | U1.29 18.4,41.67 v17.91,42.16
  Bottom 0.152: v17.91,42.16 17.91,45.59 18.29,45.97 18.29,50.04 v16.76,51.56
RX  (via drill 0.35)
  Top 0.152: v22.23,35.18 22.26,35.15 IC1.1 | U1.30 19.76,42.48 20.09,42.14 20.09,41.91 20.99,41.02 v22.23,41.02
  Bottom 0.152: v22.23,41.02 23.37,39.88 23.37,36.32 v22.23,35.18
SCK  (via drill 0.35)
  Top 0.152: PROG.5 14.77,55.25 15.62,54.4 R4.2 16.24,54.38 v16.24,52.94 | U1.17 12.06,38.6 12.83,39.37 12.83,43.31 v13.08,43.56
  Bottom 0.152: v13.08,43.56 15.61,46.09 15.61,52.31 v16.24,52.94
STEP  (via drill 0.35)
  Top 0.152: U1.11 11.37,42.48 v12.07,41.78 | v14.99,41.4 16,40.39 v17.78,40.39 | v20.7,39.75 20.83,39.62 25.91,39.62 28.7,42.42 32.51,42.42 FLOPPY.20
  Bottom 0.152: v14.99,41.4 12.45,41.4 v12.07,41.78 | v17.78,40.39 18.41,40.39 19.05,39.75 v20.7,39.75 | FLOPPY.20 32.51,42.42 29.97,42.42 28.19,40.64 28.19,37.34 28.07,37.21 28.07,25.27 26.92,24.13 26.92,20.96 22.49,16.52 FLOPPY_26.14
TRK0  (via drill 0.35)
  Top 0.152: v29.21,37.34 20.45,37.34 v20.19,37.59 | v17.78,39.12 17.27,39.62 v14.99,39.62 | v12.07,39.88 11.81,40.13 11.81,41.02 11.16,41.67 U1.12 | v26.29,18.67 v26.29,12.95
  Bottom 0.152: FLOPPY.26 32.51,37.34 v29.21,37.34 28.7,36.83 28.7,24.89 27.56,23.75 27.56,19.94 v26.29,18.67 | v20.19,37.59 18.67,39.12 v17.78,39.12 | v14.99,39.62 12.32,39.62 v12.07,39.88 | FLOPPY_26.20 23.85,10.52 v26.29,12.95
TX  (via drill 0.35)
  Top 0.152: IC1.5 19.66,34.77 v20.07,35.18 | U1.31 19.72,43.28 20.83,42.16 v20.83,42.04
  Bottom 0.152: v20.83,42.04 20.83,41.02 22.1,39.75 22.1,37.21 v20.07,35.18
VCC  (via drill 0.35)
  Top 0.152: R1.1 13.75,56.09 13.34,56.52 8.89,56.52 | R3.2 9.67,32.95 C5.1
  Top 0.406: 13.34,44.45 13.66,44.77 U1.6 | 20.32,31.66 C6.1 R2.2 | 20.32,31.66 17.02,31.66 | IC1.4 20.31,31.67 20.32,31.66 | C2.1 17.31,48.55 15.51,46.76 15.51,46.46 15.26,46.2 U1.4 15.26,44.85 14.86,44.45 14.1,44.45 13.97,44.32 | U1.20 14.46,37.74 14.1,38.1 13.59,38.1
  Top 0.508: 10.67,45.47 11.68,44.45 | v17.06,28.45 IC1.20 17.06,24.64
  Top 0.61: USB.VBUS 7.19,47.95 8.89,47.95 | 8.89,47.95 C3.1 10.67,45.47 | C4.1 15.05,64.2 POWER.4 | C4.1 C7.1 | C4.1 15.05,62.86 PROG.2 8.89,60.71 8.89,56.52 8.89,47.95 | 11.68,44.45 13.34,44.45 14.1,44.45 | 13.97,44.32 13.97,42.8 13.59,42.42 13.59,38.1 13.21,38.1 12.86,37.75 U1.18 12.86,35.02 11.3,33.46 C5.1 11.56,32.95 12.85,31.66 17.02,31.66 17.06,31.62 v17.06,28.45 | C8.1 18.22,22.55 17.06,23.71 17.06,24.64 | C8.1 C9.1 | v18.92,22.99 18.22,22.29 C8.1
  Bottom 0.61: FLOPPY_26.1 20.12,29.52 19.43,28.83 19.43,28.45 | 20.07,25.52 FLOPPY_26.5 | 19.43,28.45 19.43,27.56 | 19.43,27.56 19.43,26.16 20.07,25.52 | FLOPPY_26.3 19.47,27.52 19.43,27.56 | 19.43,28.45 v17.06,28.45 | 20.07,25.52 19.43,24.87 19.43,23.5 v18.92,22.99
WDATA  (via drill 0.35)
  Top 0.152: U1.1 17.66,43.31 17.02,42.67 v17.02,41.15 | 29.4,39.18 21.41,39.18 v21.16,38.93 | FLOPPY.22 32.51,39.88 30.1,39.88 29.4,39.18 | v29.85,36.58 29.97,36.7 29.97,37.85 29.4,38.42 29.4,39.18
  Bottom 0.152: v17.02,41.15 17.02,40.26 17.53,39.75 18.54,39.75 19.37,38.93 v21.16,38.93 | FLOPPY_26.16 23.79,14.52 28.19,18.92 28.19,23.75 29.08,24.64 29.08,35.81 v29.85,36.58
WGATE  (via drill 0.35)
  Top 0.152: U1.23 16.86,37.56 17.27,37.97 18.16,37.97 18.8,37.34 19.43,37.34 19.81,36.96 28.19,36.96 v29.85,35.31 30.16,34.99 31.94,34.99 32.51,35.56 32.51,37.34 FLOPPY.24
  Bottom 0.152: FLOPPY_26.18 23.82,12.52 28.83,17.53 28.83,23.75 29.46,24.38 29.46,34.93 v29.85,35.31
WPROTECT
  Top 0.152: U1.24 19.18,36.98 19.59,36.58 26.35,36.58 28.32,34.61 32.7,34.61 FLOPPY.28
  Bottom 0.152: FLOPPY.28 32.51,32.26 30.48,32.26 30.1,31.88 30.1,24 29.46,23.37 29.46,14.1 23.88,8.51 FLOPPY_26.22

### Text on the board
tPlace: 1 | GN | 5V | 5V | MI | MO | CK | RS | rev 06 / by C.Z.